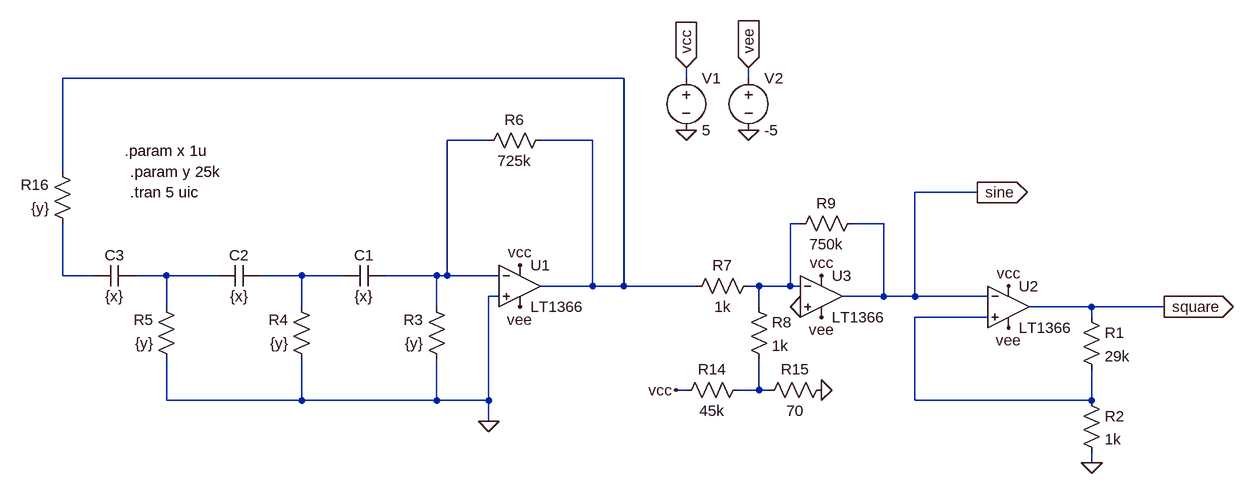
[diagram p0: schematic Draft37.asc]
Draft37.asc, the LTspice schematic file:
Version 4
SHEET 1 1416 680
WIRE 464 48 -400 48
WIRE 560 48 560 32
WIRE 656 48 656 32
WIRE 256 144 192 144
WIRE 416 144 336 144
WIRE -400 192 -400 48
WIRE 1008 224 912 224
WIRE 736 272 720 272
WIRE 864 272 816 272
WIRE -400 352 -400 272
WIRE -352 352 -400 352
WIRE -240 352 -288 352
WIRE -160 352 -240 352
WIRE -32 352 -96 352
WIRE 32 352 -32 352
WIRE 176 352 96 352
WIRE 192 352 192 144
WIRE 192 352 176 352
WIRE 272 352 192 352
WIRE 416 368 416 144
WIRE 416 368 336 368
WIRE 464 368 464 48
WIRE 464 368 416 368
WIRE 576 368 464 368
WIRE 672 368 656 368
WIRE 720 368 720 272
WIRE 720 368 672 368
WIRE 736 368 720 368
WIRE 272 384 256 384
WIRE 864 384 864 272
WIRE 864 384 800 384
WIRE 912 384 912 224
WIRE 912 384 864 384
WIRE 1024 384 912 384
WIRE -240 400 -240 352
WIRE -32 400 -32 352
WIRE 176 400 176 352
WIRE 672 400 672 368
WIRE 1184 400 1088 400
WIRE 1296 400 1184 400
WIRE 1024 416 912 416
WIRE 1184 416 1184 400
WIRE 560 528 544 528
WIRE 672 528 672 480
WIRE 672 528 640 528
WIRE 688 528 672 528
WIRE -240 544 -240 480
WIRE -32 544 -32 480
WIRE -32 544 -240 544
WIRE 176 544 176 480
WIRE 176 544 -32 544
WIRE 256 544 256 384
WIRE 256 544 176 544
WIRE 912 544 912 416
WIRE 1184 544 1184 496
WIRE 1184 544 912 544
WIRE 256 576 256 544
WIRE 1184 640 1184 624
FLAG 1184 640 0
FLAG 256 576 0
FLAG 560 32 vcc
IOPIN 560 32 In
FLAG 656 32 vee
IOPIN 656 32 In
FLAG 304 336 vcc
FLAG 304 400 vee
FLAG 1296 400 square
IOPIN 1296 400 Out
FLAG 736 400 0
FLAG 768 352 vcc
FLAG 768 416 vee
FLAG 768 528 0
FLAG 544 528 vcc
FLAG 1008 224 sine
IOPIN 1008 224 Out
FLAG 656 128 0
FLAG 560 128 0
FLAG 1056 368 vcc
FLAG 1056 432 vee
SYMBOL res 1168 400 R0
SYMATTR InstName R1
SYMATTR Value 29k
SYMBOL res 1168 528 R0
SYMATTR InstName R2
SYMATTR Value 1k
SYMBOL cap 96 336 R90
WINDOW 0 0 32 VBottom 2
WINDOW 3 32 32 VTop 2
SYMATTR InstName C1
SYMATTR Value {x}
SYMBOL cap -96 336 R90
WINDOW 0 0 32 VBottom 2
WINDOW 3 32 32 VTop 2
SYMATTR InstName C2
SYMATTR Value {x}
SYMBOL cap -288 336 R90
WINDOW 0 0 32 VBottom 2
WINDOW 3 32 32 VTop 2
SYMATTR InstName C3
SYMATTR Value {x}
SYMBOL res 192 496 R180
WINDOW 0 36 76 Left 2
WINDOW 3 36 40 Left 2
SYMATTR InstName R3
SYMATTR Value {y}
SYMBOL res -16 496 R180
WINDOW 0 36 76 Left 2
WINDOW 3 36 40 Left 2
SYMATTR InstName R4
SYMATTR Value {y}
SYMBOL res -224 496 R180
WINDOW 0 36 76 Left 2
WINDOW 3 36 40 Left 2
SYMATTR InstName R5
SYMATTR Value {y}
SYMBOL Opamps/LT1366 304 304 R0
SYMATTR InstName U1
SYMBOL Opamps/LT1366 1056 336 R0
SYMATTR InstName U2
SYMBOL res 352 128 R90
WINDOW 0 0 56 VBottom 2
WINDOW 3 32 56 VTop 2
SYMATTR InstName R6
SYMATTR Value 725k
SYMBOL Opamps/LT1366 768 320 R0
SYMATTR InstName U3
SYMBOL res 672 352 R90
WINDOW 0 0 56 VBottom 2
WINDOW 3 32 56 VTop 2
SYMATTR InstName R7
SYMATTR Value 1k
SYMBOL res 656 384 R0
SYMATTR InstName R8
SYMATTR Value 1k
SYMBOL res 832 256 R90
WINDOW 0 0 56 VBottom 2
WINDOW 3 32 56 VTop 2
SYMATTR InstName R9
SYMATTR Value 750k
SYMBOL res 544 544 R270
WINDOW 0 32 56 VTop 2
WINDOW 3 0 56 VBottom 2
SYMATTR InstName R14
SYMATTR Value 45k
SYMBOL res 672 544 R270
WINDOW 0 32 56 VTop 2
WINDOW 3 0 56 VBottom 2
SYMATTR InstName R15
SYMATTR Value 70
SYMBOL res -384 288 R180
WINDOW 0 36 76 Left 2
WINDOW 3 36 40 Left 2
SYMATTR InstName R16
SYMATTR Value {y}
SYMBOL voltage 560 32 R0
SYMATTR InstName V1
SYMATTR Value 5
SYMBOL voltage 656 32 R0
SYMATTR InstName V2
SYMATTR Value -5
TEXT -304 160 Left 2 !.param x 1u
TEXT -296 192 Left 2 !.param y 25k
TEXT -296 224 Left 2 !.tran 5 uic

The netlist it stands for:
* Draft37.asc
R1 square N007 29k
R2 N007 0 1k
C1 N002 N006 {x}
C2 N006 N005 {x}
C3 N005 N004 {x}
R3 0 N002 {y}
R4 0 N006 {y}
R5 0 N005 {y}
XU1 0 N002 vcc vee N001 LT1366  ; pins In+ In- V+ V- OUT
XU2 N007 sine vcc vee square LT1366  ; pins In+ In- V+ V- OUT
R6 N001 N002 725k
XU3 0 N003 vcc vee sine LT1366  ; pins In+ In- V+ V- OUT
R7 N003 N001 1k
R8 N003 N008 1k
R9 sine N003 750k
R14 vcc N008 45k
R15 N008 0 70
R16 N004 N001 {y}
V1 vcc 0 5
V2 vee 0 -5
.param x 1u
.param y 25k
.tran 5 uic
.lib LTC.lib
.backanno
.end